# Altium schematic sheet lipo battery charger schemATIC.SchDoc
size A4; SheetNumber: 1; SheetTotal: 1
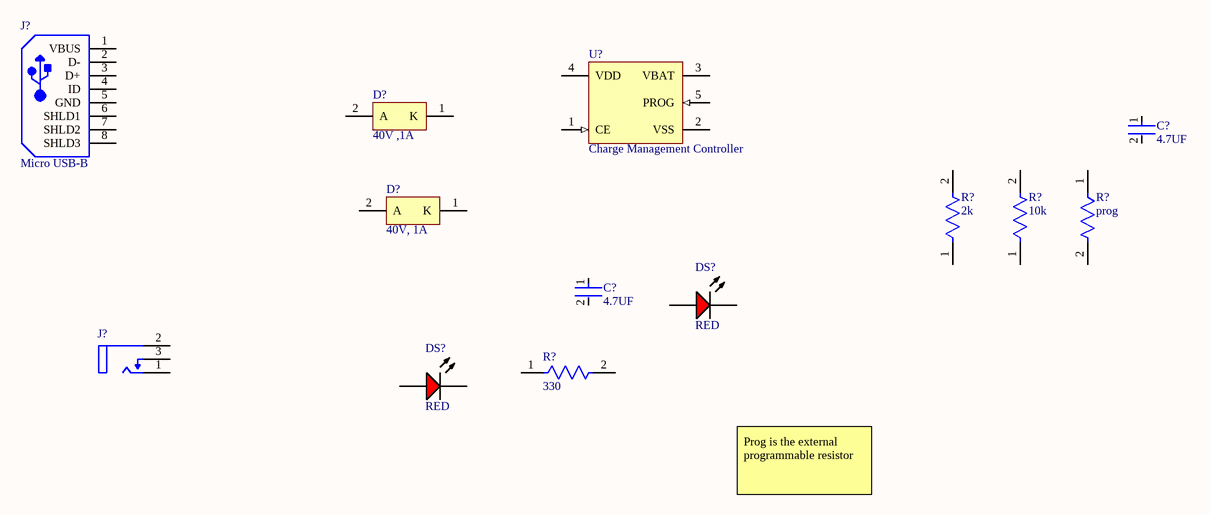
[diagram p0: lipo battery charger schemATIC.SchDoc]

## Parts
(Parts that share a designator on the sheet are numbered #1, #2 ... from top to bottom, then left to right.)
C?#1  4.7UF  [FP-CC0805-0_85-MFG]
C?#2  4.7UF  [FP-CC0805-0_85-MFG]
D?#1  40V ,1A  [ONSC-SMA-2-403D-02_V]
D?#2  40V, 1A  [ONSC-SMA-2-403D-02_V]
DS?#1  RED  [VISH-TLMS1000_V]
DS?#2  RED  [VISH-TLMS1000_V]
J?#1  Micro USB-B  [MOLX-105133-0001_V]
J?#2  (no value)  [FP-RASM722PTR13X-MFG]
R?#1  prog  [FP-RS02B-MFG]
R?#2  2k  [FP-RN73R1E-IPC_B]
R?#3  10k  [FP-RN73R2A-IPC_A]
R?#4  330  [FP-CRCW0805-e3-MFG]
U?  Charge Management Controller  [SOT-23-OT5_M]

## Nets

Not connected (* = marked no-connect by the designer): C?#1 1 2; C?#2 1 2; D?#1 1(K) 2(A); D?#2 1(K) 2(A); DS?#1 1(A) 2(K); DS?#2 1(A) 2(K); J?#1 1(VBUS) 2(D-) 3(D+) 4(ID) 5(GND) 6(SHLD1) 7(SHLD2) 8(SHLD3); J?#2 1(TIP_TERMINAL(CENTER_PIN)) 2(SLEEVE_TERMINAL) 3(SHUNT_TERMINAL); R?#1 1 2; R?#2 1 2; R?#3 1 2; R?#4 1 2; U? 1(CE) 2(VSS) 3(VBAT) 4(VDD) 5(PROG)

## Notes on the sheet
- Prog is the external programmable resistor

## Library data of the parts
C?#1 C?#2 = CMP-03422-001342-1: CAP CER 4.7UF 6.3V X7R 0805; Manufacturer: Yageo; Manufacturer Part Number: CC0805KKX7R5BB475; Tolerance: 0.1; Material: Ceramic; Automotive: No; Temperature Characteristic: X7R; Package: CC0805-0.85; Value: 4.7 uF; Capacitance: 4.7 uF; Voltage Rating: 6.3 V; Octopart: https://octopart.com/cc0805kkx7r5bb475-yageo-27548069; Category: Cap; Digikey Description: CAP CER 4.7UF 6.3V X7R 0805; Device Class L3: Ceramic Capacitors; Temperature: -30°C to +85°C; ComponentLink2URL: http://www.yageo.com/documents/recent/UPY-GPHC_Y5V_6.3V-to-50V_8.pdf; Mouser Description: Multilayer Ceramic Capacitors MLCC - SMD/SMT 4.7uF 6.3V X7R 10%; Temperature Range High: +85°C; RoHS: TRUE; Device Class L2: Capacitors; ComponentLink2Description: Datasheet; Height: 0.95mm; Device Class L1: Passive Components; Ipc Land Pattern Name: CAPC200125X85; Lead Free: Yes; Temperature Range Low: -30°C; Footprint Url: http://www.yageo.com/exep/pages/download/literatures/UPY-C_GEN_24.pdf
D?#1 D?#2 = CMP-1055-00320-1: Schottky Power Rectifier, 2-Pin SMA, Pb-Free, Tape and Reel; PartNumber: MBRA140T3G; Manufacturer: On Semiconductor; Configuration: Single; IFSM Max (A): 30; PackageReference: SMA-2-403D-02; PackageDescription: 2-Pin Small Molded Package, J-Bend Lead, Body 2.605 x 4.315 mm; RoHS: TRUE; ComponentLink1Description: Manufacturer URL; Packing: Tape and Reel; ComponentLink3URL: http://www.onsemi.com/pub_link/Collateral/403D-02.PDF; ComponentLink2Description: Datasheet; ComponentLink2URL: http://www.onsemi.cn/pub_link/Collateral/MBRA140T3-D.PDF; DatasheetVersion: Rev. 10; ComponentLink1URL: http://www.onsemi.com/; ComponentLink3Description: Package Specification; Mounting Technology: Surface Mount; PackageVersion: Rev. G, 07/2012
DS?#1 DS?#2 = CMP-2000-07254-1: Low Current LED, 40 mW, 1.8 V, -40 to 100 degC, 2-Pin SMD (0603), RoHS, Tape and Reel; Manufacturer: Vishay; Lens Shape: Rectangular; Automotive Qualification Standard: AEC-Q100; Wavelength Typ: 636nm; SVHC: ToBeAdvised; Bulb Size: 1.6mmx0.8mm; Forward Voltage: 1.8V; Luminous Intensity: 4mcd; Forward Current If: 2mA; Viewing Angle: 80°; Datasheet Version: Rev. 1.7, 02/2011; Datasheet URL: https://datasheet.ciiva.com/5798/1698881-5798337.pdf; LED Mounting: SMD; Packaging: CutTape; Package Reference: TLMS1000; Manufacturer URL: http://www.vishay.com/; Mounting Technology: SurfaceMount; Product Range: -; LED Colour: Red; Package Description: 2-Pin Surface Mount Device, Body 1.6 x 0.8 mm; MSL: MSL2-1year
J?#1 = CMP-2000-05829-1: Micro-USB B Receptacle, Vertical, -30 to 85 degC, 5-Pin SMD, RoHS, Tape and Reel; Manufacturer: Molex; PartNumber: 105133-0001; Package Version: Rev. C, 11/2015; Voltage Rating: 30VAC; Connector Type: MicroUSBTypeBReceptacle; Current Rating: 1.8A; Number of Ports: 1; Voltage - Max: 30V; Mounting Style: SMD/SMT; Packaging: Reel; Product: MicroUSBTypeBConnectors; Contact Plating: Gold; Flammability Rating: UL94V-0; Package Description: 5-Pin Surface Mount Device, Pitch 0.65 mm; Package Reference: 105133-0001; Contact Material: CopperAlloy; Mounting Angle: Vertical; RoHS: Details; Manufacturer URL: http://www.molex.com/; Factory Pack Quantity: 6000; Standard: USB; Brand: Molex; Series: 105133; Product Category: USBConnectors; Termination Style: SolderTail; Gender: Receptacle; Package URL: http://www.molex.com/pdm_docs/sd/1051330001_sd.pdf; Datasheet Version: 03/2016; Color: Black; Datasheet URL: http://www.molex.com/webdocs/datasheets/pdf/en-us/1051330001_IO_CONNECTORS.pdf; Mounting Technology: SurfaceMount
J?#2 = CMP-47995-000002-1: CONN PWR JACK 2.1X5.5MM SOLDER; Shielding: Unshielded; Gender: Male; Current Rating: 5A; Termination: Solder; Contact Material: Copper Alloy; Package Quantity: 120; Case/Package: SMD/SMT; Contact Plating: Tin; Connector Type: Jack; Housing Material: Thermoplastic; Mount: Surface Mount; Housing Color: Black; Color: Black
R?#1 = CMP-02408-000037-1: Res Wirewound 12K Ohm 1% 3W ±20ppm/°C Ceramic Hi Temp Sil AXL Thru-Hole Bulk; Resistance: 12kR; Lead Diameter: 0.81mm; Resistor Type: Wirewound; Case/Package: Ceramic; Contact Plating: Tin; Diameter: 4.75mm; Length: 14.22mm; Min Operating Temperature: -65°C; Lead Free: Lead Free; Tolerance: 1%; Power Rating: 3W; Termination: Axial; RoHS Compliant: Yes; Series: RS; Package Quantity: 100; Width: 4.75mm; Temperature Coefficient: 20ppm/°C; Mount: Through Hole; Weight: 0.024692oz; Max Operating Temperature: 250°C
R?#2 = CMP-04015-046600-1: 2kΩ ±1% 0.063W, 1/16W Chip Resistor 0402 (1005 Metric) Moisture Resistant Thin Film
R?#3 = CMP-04015-052084-1: RES 10K OHM 0.1% 1/8W 0805
R?#4 = CMP-2001-03823-2: RES Thick Film, 330Ω, 1%, 0.125W, 100ppm/°C, 0805; Voltage Rating (DC): 150V; Resistance: 330R; Max Power Dissipation: 125mW; Mount: Surface Mount; Packaging: Tape and Reel; Min Operating Temperature: -55°C; Military Standard: Not; Case Code (Metric): 2012; Height: 0.02inch; Voltage Rating: 150V; Case/Package: 0805; Max Operating Temperature: 155°C; Width: 0.049inch; Case Code (Imperial): 0805; Termination: SMD/SMT; Lead Free: Lead Free; Contact Plating: Tin; Package Quantity: 10; Composition: Thick Film; Length: 2mm; Features: Automotive AEC-Q200; Depth: 1.25mm; Weight: 0.000194oz; Tolerance: 1%; Power Rating: 125mW; Number of Terminations: 2; Temperature Coefficient: 100ppm/°C
U? = CMP-0133-00139-1: Simple, Miniature Single-Cell, Fully Integrated Li-Ion/Li-Polymer Charge Management Controller, 4.2V, 5-Pin SOT-23, Industrial Temperature, Tape and Reel; Code_IPC: SOT23-5; PackageDescription: 5-Lead Plastic Small Outline Transistor (OT) [SOT-23]; PackageVersion: revBB, Aug-2009; DatasheetVersion: revB, Sep-2007; PackageReference: SOT-23-OT5